# Altium schematic sheet Sensor.SchDoc
size A4
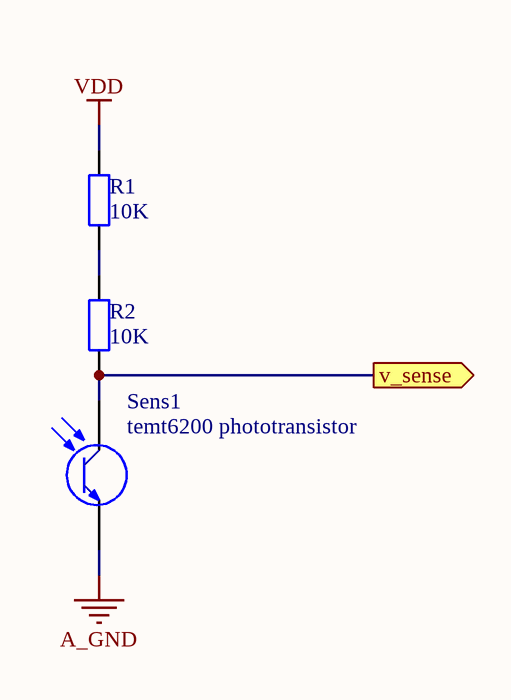
[diagram p0: Sensor.SchDoc]

## Parts
R1  10K
R2  10K
Sens1  temt6200 phototransistor  [ECE-SENSOR-0805SM]

## Ports
v_sense (out)

## Nets
A_GND: Sens1.1(E)
VDD: R1.2
v_sense: R2.1 Sens1.2(C) ; port v_sense
NetR1_1: R1.1 R2.2

## Library data of the parts
R1 R2 = Resistor: Value: *
Sens1 = TEMT6200: Light Sensor TEMT6200; Revision: July-2002: Re-released for DXP Platform.